# Altium schematic sheet MCU.SchDoc: MCU
size Letter; ApprovedBy: APPROUVÉ PAR; Author: Thomas Lajoie; Organization: Cegep Limoilou; Address1: 1300, 8e Avenue; Address2: Québec, QC; Address3: Canada; Address4: G1J 5L5; Revision: A; SheetNumber: 2; SheetTotal: 6
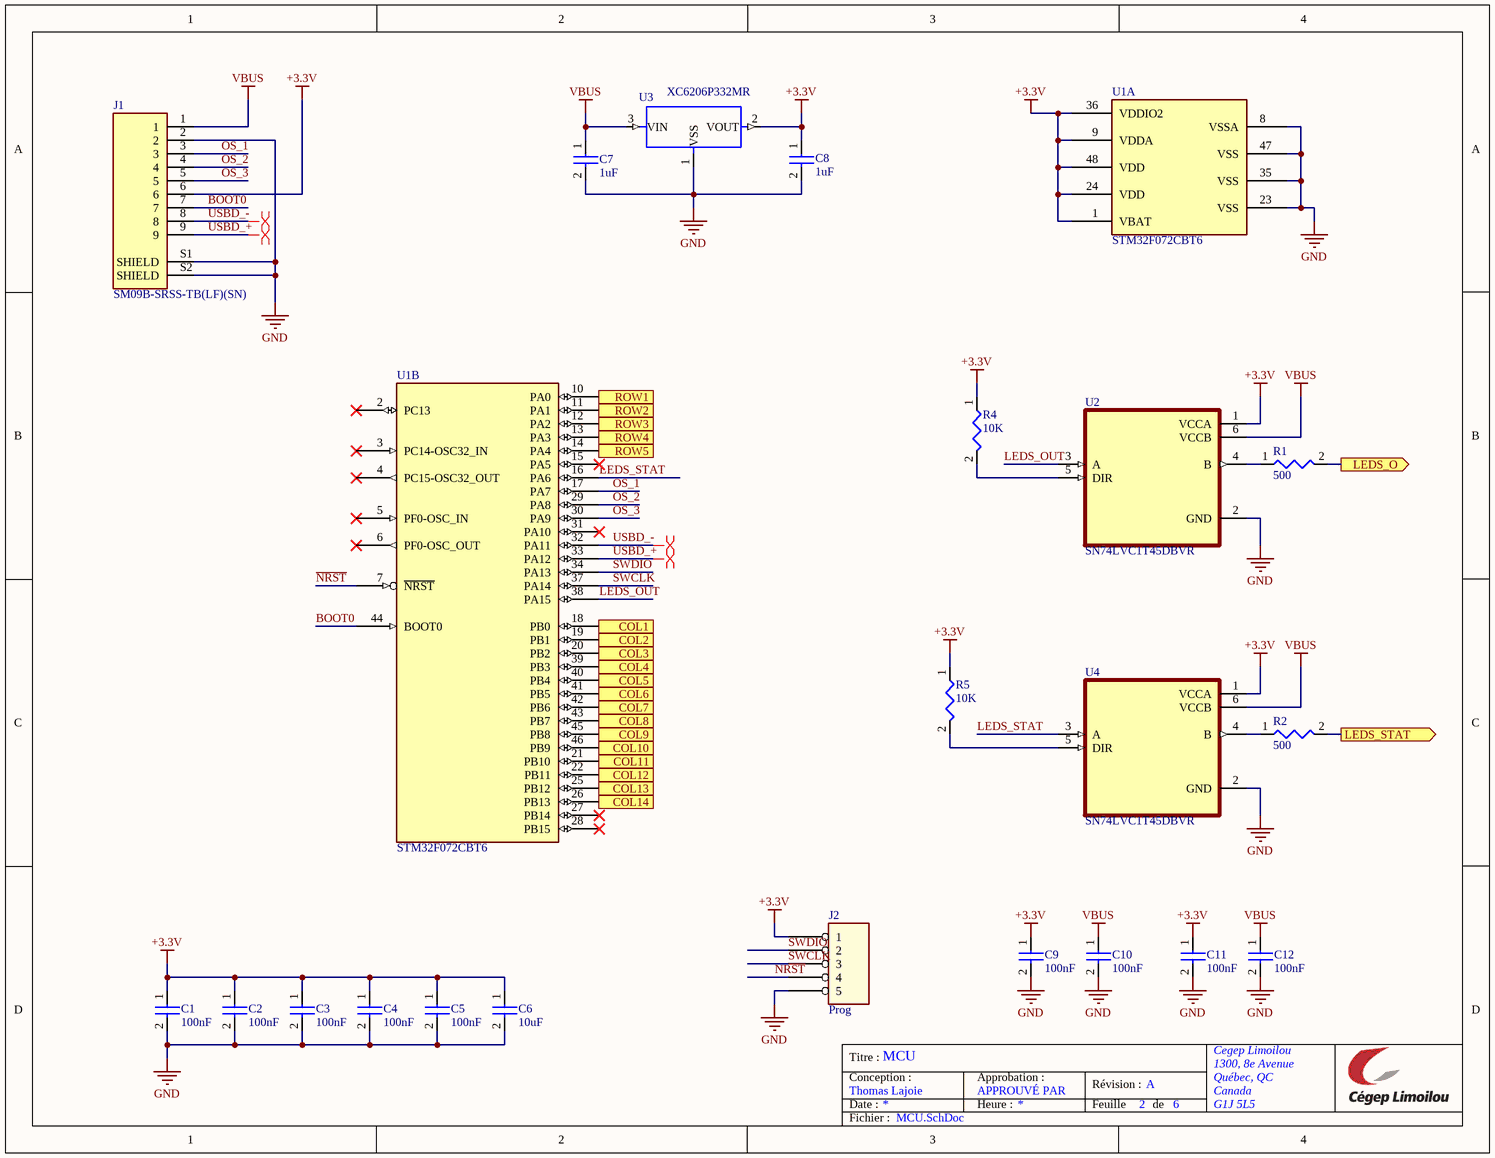
[diagram p0: MCU.SchDoc]

## Parts
C1  100nF  [CL10B104KA8NNNC]
C2  100nF  [CL10B104KA8NNNC]
C3  100nF  [CL10B104KA8NNNC]
C4  100nF  [CL10B104KA8NNNC]
C5  100nF  [CL10B104KA8NNNC]
C6  10uF  [CL10A106KP8NNNC]
C7  1uF  [CL10A105KA8NNNC]
C8  1uF  [CL10A105KA8NNNC]
C9  100nF  [CL10B104KA8NNNC]
C10  100nF  [CL10B104KA8NNNC]
C11  100nF  [CL10B104KA8NNNC]
C12  100nF  [CL10B104KA8NNNC]
J1  SM09B-SRSS-TB(LF)(SN)  [JST_SM09B-SRSS-TB(LF)(SN)]
J2  Prog  [TE_5-146280-5]
R1  500  [0603WAF5100T5E]
R2  500  [0603WAF5100T5E]
R4  10K  [0603WAJ0103T5E]
R5  10K  [0603WAJ0103T5E]
U1  STM32F072CBT6  [QFP50P900X900X160-48N]  (parts A,B of 2)
U2  SN74LVC1T45DBVR  [SOT95P280X145-6N]
U3  XC6206P332MR  [SOT-23]
U4  SN74LVC1T45DBVR  [SOT95P280X145-6N]

## Ports
COL1 (out), COL2 (out), COL3 (out), COL4 (out), COL5 (out), COL6 (out), COL7 (out), COL8 (out), COL9 (out), COL10 (out), COL11 (out), COL12 (out), COL13 (out), COL14 (out), LEDS_O (out), LEDS_STAT (out), ROW1 (in), ROW2 (in), ROW3 (in), ROW4 (in), ROW5 (in)

## Nets
+3.3V: C1.1 C2.1 C3.1 C4.1 C5.1 C6.1 C8.1 C9.1 C11.1 J1.6 J2.1 R4.1 R5.1 U1.1(VBAT) U1.9(VDDA) U1.24(VDD) U1.36(VDDIO2) U1.48(VDD) U2.1(VCCA) U3.2(VOUT) U4.1(VCCA)
GND: C1.2 C2.2 C3.2 C4.2 C5.2 C6.2 C7.2 C8.2 C9.2 C10.2 C11.2 C12.2 J1.2 J1.S1(SHIELD) J1.S2(SHIELD) J2.5 U1.8(VSSA) U1.23(VSS) U1.35(VSS) U1.47(VSS) U2.2(GND) U3.1(VSS) U4.2(GND)
VBUS: C7.1 C10.1 C12.1 J1.1 U2.6(VCCB) U3.3(VIN) U4.6(VCCB)
~{NRST}: J2.4 U1.7(~{NRST})
BOOT0: J1.7 U1.44(BOOT0)
COL1: U1.18(PB0) ; port COL1
COL2: U1.19(PB1) ; port COL2
COL3: U1.20(PB2) ; port COL3
COL4: U1.39(PB3) ; port COL4
COL5: U1.40(PB4) ; port COL5
COL6: U1.41(PB5) ; port COL6
COL7: U1.42(PB6) ; port COL7
COL8: U1.43(PB7) ; port COL8
COL9: U1.45(PB8) ; port COL9
COL10: U1.46(PB9) ; port COL10
COL11: U1.21(PB10) ; port COL11
COL12: U1.22(PB11) ; port COL12
COL13: U1.25(PB12) ; port COL13
COL14: U1.26(PB13) ; port COL14
LEDS_O: R1.2 ; port LEDS_O
LEDS_OUT: U1.38(PA15) U2.3(A)
LEDS_STAT: U1.16(PA6) U4.3(A)
LEDS_STAT: R2.2 ; port LEDS_STAT  [a separate net that carries the same name]
OS_1: J1.3 U1.17(PA7)
OS_2: J1.4 U1.29(PA8)
OS_3: J1.5 U1.30(PA9)
ROW1: U1.10(PA0) ; port ROW1
ROW2: U1.11(PA1) ; port ROW2
ROW3: U1.12(PA2) ; port ROW3
ROW4: U1.13(PA3) ; port ROW4
ROW5: U1.14(PA4) ; port ROW5
SWCLK: J2.3 U1.37(PA14)
SWDIO: J2.2 U1.34(PA13)
USBD_+: J1.9 U1.33(PA12)
USBD_-: J1.8 U1.32(PA11)
NetR1_1: R1.1 U2.4(B)
NetR2_1: R2.1 U4.4(B)
NetR4_2: R4.2 U2.5(DIR)
NetR5_2: R5.2 U4.5(DIR)

Not connected (* = marked no-connect by the designer): U1 2(PC13)* 3(PC14-OSC32_IN)* 4(PC15-OSC32_OUT)* 5(PF0-OSC_IN)* 6(PF0-OSC_OUT)* 15(PA5)* 27(PB14)* 28(PB15)* 31(PA10)*

## Layout directives
differential pair: USBD_+, USBD_-

## Notes on the sheet
- Titre :
- Conception :
- Date :
- Approbation :
- Heure :
- Révision :
- Feuille
- de
- Fichier :

## Library data of the parts
C1-C12 = CAP NP
  C1: ComponentLink1Description: New link; ComponentLink1URL: *; LCSC Part #: C1590
  C2-C5 C9-C12: LCSC Part #: C1590
  C6: LCSC Part #: C19702
  C7 C8: LCSC Part #: C5673
J1 = SM09B-SRSS-TB(LF)(SN): Connector Header Surface Mount, Right Angle 9 position 0.039 (1.00mm); MF: JST Sales America Inc.; SnapEDA_Link: https://www.snapeda.com/parts/SM09B-SRSS-TB(LF)(SN)/JST/view-part/?ref=snap; Package: None; Value: *; MP: SM09B-SRSS-TB(LF)(SN); Check_prices: https://www.snapeda.com/parts/SM09B-SRSS-TB(LF)(SN)/JST/view-part/?ref=eda; LCSC Part #: C160408
J2 = HEADER 5
R1 R2 R4 R5 = R
  R1 R2: LCSC Part #: C23193
  R4 R5: LCSC Part #: C15401
U2 U4 = SN74LVC1T45DBVR: Single-Bit Dual-Supply Bus Transceiver with Configurable Voltage-Level Shifting and 3-State Outputs 6-SOT-23 -40 to 85; MF: Texas Instruments; Package: SOT-23-6 Texas Instruments; Purchase-URL: https://pricing.snapeda.com/search/part/SN74LVC1T45DBVR/?ref=eda; MP: SN74LVC1T45DBVR; Availability: Good; SnapEDA_Link: https://www.snapeda.com/parts/SN74LVC1T45DBVR/Texas%20Instruments/view-part/106485/?ref=snap; Price: None; LCSC Part #: C7843
  U2: Check_prices: https://www.snapeda.com/parts/SN74LVC1T45DBVR/Texas%20Instruments/view-part/106485/?ref=eda
U3 = PMIC-LDO-XC6206P332MR-G(SOT23): Linear Voltage Regulator IC Positive Fixed 1 Output 200mA SOT-23; MF: Torex; Check_prices: https://www.snapeda.com/parts/XC6206P332MR-G/Torex/view-part/?ref=eda; Purchase-URL: https://pricing.snapeda.com/search/part/XC6206P332MR-G/?ref=eda; Value: *; Availability: In Stock; Package: SOT-23-3 Torex; SnapEDA_Link: https://www.snapeda.com/parts/XC6206P332MR-G/Torex/view-part/?ref=snap; MP: XC6206P332MR-G; Price: None; LCSC Part #: C5446